# Altium schematic sheet Sheet2.SchDoc
size A4
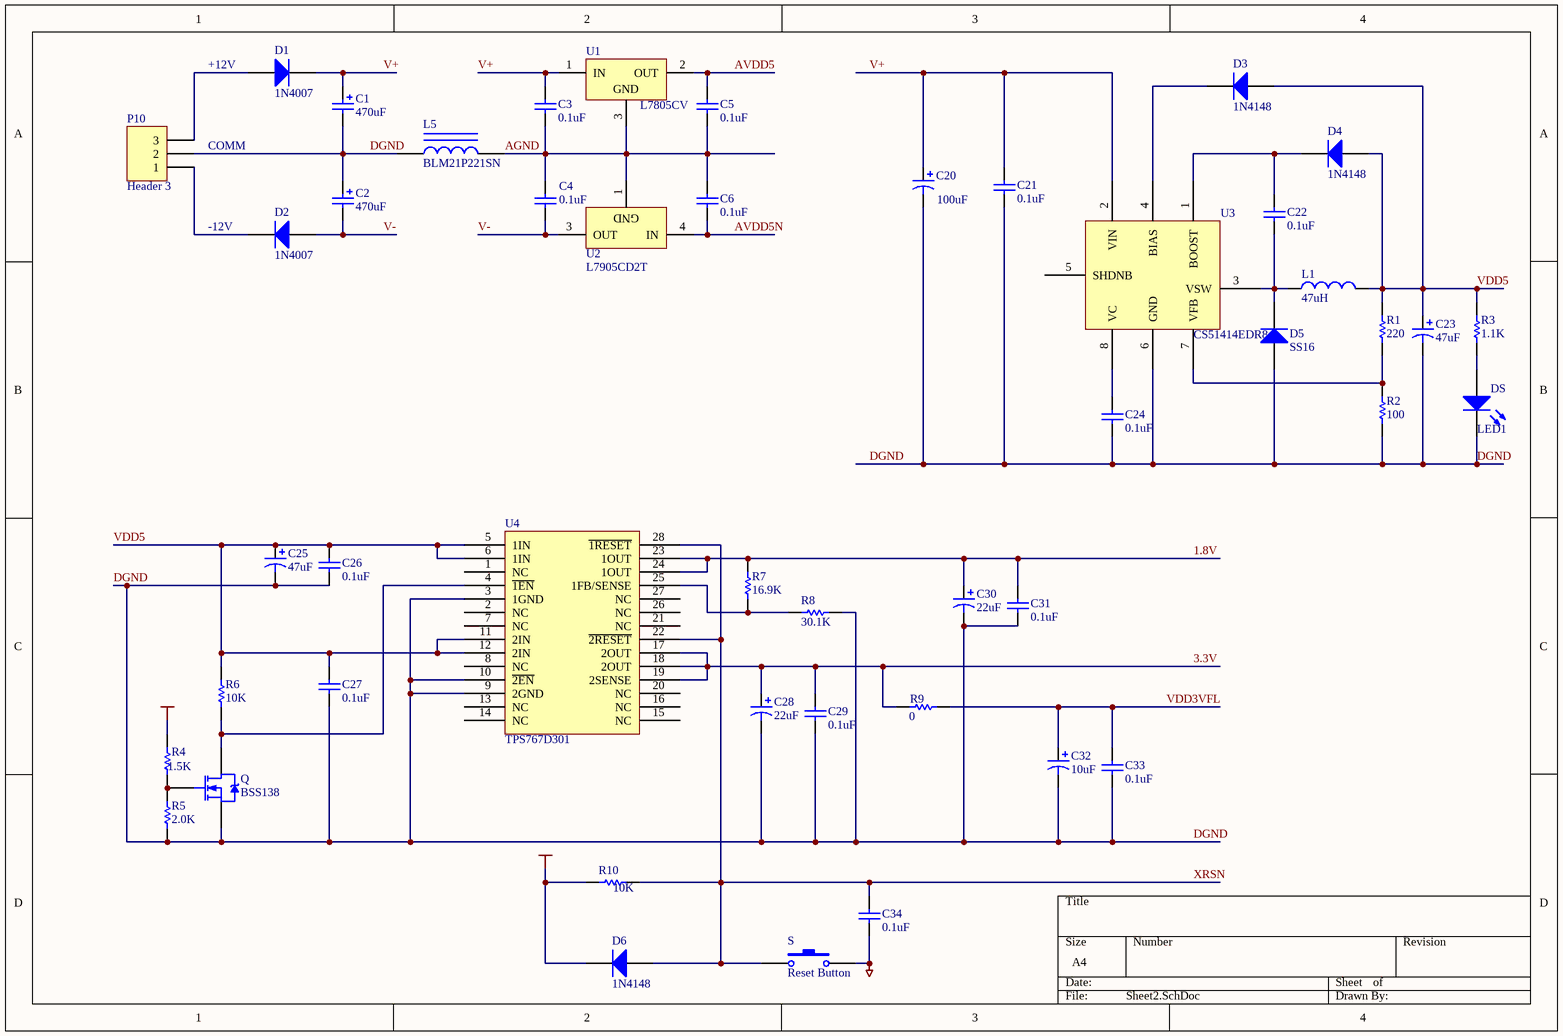
[diagram p0: Sheet2.SchDoc]

## Parts
C1  470uF  [C0915-0508]
C2  470uF  [C0915-0508]
C3  0.1uF  [CC2012-0805]
C4  0.1uF  [CC2012-0805]
C5  0.1uF  [CC2012-0805]
C6  0.1uF  [CC2012-0805]
C20  100uF  [C0915-0350]
C21  0.1uF  [CC2012-0805]
C22  0.1uF  [CC2012-0805]
C23  47uF  [CA2522-0612]
C24  0.1uF  [CC2012-0805]
C25  47uF  [CA2522-0612]
C26  0.1uF  [CC2012-0805]
C27  0.1uF  [CC2012-0805]
C28  22uF  [CA2222-0350]
C29  0.1uF  [CC2012-0805]
C30  22uF  [CA2222-0350]
C31  0.1uF  [CC2012-0805]
C32  10uF  [CA2222-0370]
C33  0.1uF  [CC2012-0805]
C34  0.1uF  [CC2012-0805]
D1  1N4007  [DO-41]
D2  1N4007  [DO-41]
D3  1N4148  [D2012-0350]
D4  1N4148  [D2012-0350]
D5  SS16  [D2220-0500]
D6  1N4148  [D2012-0350]
DS  LED1  [LED-1]
L1  47uH  [L2025-0712]
L5  BLM21P221SN  [CR2012-0805]
P10  Header 3  [HEADER3]
Q  BSS138  [SO-G3/Z3.3]
R1  220  [CR2012-0805]
R2  100  [CR2012-0805]
R3  1.1K  [CR2012-0805]
R4  1.5K  [CR2012-0805]
R5  2.0K  [CR2012-0805]
R6  10K  [CR2012-0805]
R7  16.9K  [CR2012-0805]
R8  30.1K  [CR2012-0805]
R9  0  [CR2012-0805]
R10  10K  [CR2012-0805]
S  Reset Button  [SW0915-4666]
U1  L7805CV  [TO220ABN]
U2  L7905CD2T  [TO-263]
U3  CS51414EDR8  [AD8021ARZ-1]
U4  TPS767D301  [TPS767D301]

## Nets
3.3V: C28.1 C29.2 D6.2(K) R4.2 R9.1 R10.1 U4.17(2OUT) U4.18(2OUT) U4.19(2SENSE)
DGND: C1.2 C2.1 C20.2 C21.1 C23.2 C24.1 C25.2 C26.1 C27.1 C28.2 C29.1 C30.2 C31.2 C32.2 C33.1 C34.1 D5.1(A) DS.2(K) L5.1 P10.2 Q.2(S) R2.1 R5.1 R8.2 S.2 U3.6(GND) U4.3(1GND) U4.9(2GND) U4.10(~{2EN})
1.8V: C30.1 C31.1 R7.2 U4.23(1OUT) U4.24(1OUT)
AGND: C3.1 C4.2 C5.1 C6.1 L5.2 U1.3(GND) U2.1(GND)
AVDD5: C5.2 U1.2(OUT)
AVDD5N: C6.2 U2.4(IN)
V+: C1.1 C3.2 C20.1 C21.2 D1.2(K) U1.1(IN) U3.2(VIN)
V-: C2.2 C4.1 D2.1(A) U2.3(OUT)
VDD3VFL: C32.1 C33.2 R9.2
VDD5: C23.1 C25.1 C26.2 C27.2 D3.1(A) D4.1(A) L1.2 R1.2 R3.2 R6.2 U4.5(1IN) U4.6(1IN) U4.11(2IN) U4.12(2IN)
XRSN: C34.2 D6.1(A) R10.2 S.1 U4.22(~{2RESET}) U4.28(~{1RESET})
NetC22_1: C22.1 D5.2(K) L1.1 U3.3(VSW)
NetC22_2: C22.2 D4.2(K) U3.1(BOOST)
NetC24_2: C24.2 U3.8(VC)
NetD1_1: D1.1(A) P10.3
NetD2_2: D2.2(K) P10.1
NetD3_2: D3.2(K) U3.4(BIAS)
NetDS_1: DS.1(A) R3.1
NetQ_1: Q.1(G) R4.1 R5.2
NetQ_3: Q.3(D) R6.1 U4.4(~{1EN})
NetR1_1: R1.1 R2.2 U3.7(VFB)
NetR7_1: R7.1 R8.1 U4.25(1FB/SENSE)

Not connected (* = marked no-connect by the designer): U3 5(SHDNB); U4 1(NC) 2(NC) 7(NC) 8(NC) 13(NC) 14(NC) 15(NC) 16(NC) 20(NC) 21(NC) 26(NC) 27(NC)

## Notes on the sheet
- (near D1) +12V
- (near P10) COMM
- -12V

## Library data of the parts
C1 C2 = Cap Pol2: Polarized Capacitor (Axial); Published: 8-Jun-2000; LatestRevisionDate: 17-Jul-2002; LatestRevisionNote: Re-released for DXP Platform.; Publisher: Altium Limited
C3-C6 = Cap Semi: Capacitor (Semiconductor SIM Model); Published: 8-Jun-2000; LatestRevisionDate: 17-Jul-2002; LatestRevisionNote: Re-released for DXP Platform.; PackageReference: C1206; Publisher: Altium Limited
C20 C23 C25 C28 C30 = Cap Pol1: Polarized Capacitor (Radial); Published: 8-Jun-2000; LatestRevisionDate: 17-Jul-2002; LatestRevisionNote: Re-released for DXP Platform.; Publisher: Altium Limited
C21 C22 C24 C26 C27 C29 C31 C33 C34 = Cap: Capacitor; Published: 8-Jun-2000; LatestRevisionDate: 17-Jul-2002; LatestRevisionNote: Re-released for DXP Platform.; Publisher: Altium Limited
C32 = Cap Pol3: Polarized Capacitor (Surface Mount); Published: 8-Jun-2000; LatestRevisionDate: 17-Jul-2002; LatestRevisionNote: Re-released for DXP Platform.; PackageReference: C0805; Publisher: Altium Limited
D1 D2 = 1N4007: 1.0 Ampere General Purpose Rectifier; Published: 8-Jun-2000; LatestRevisionDate: 17-Jul-2002; LatestRevisionNote: Re-released for DXP Platform.; DatasheetDocument: 1998; PackageDocument: Aug-1999; PackageReference: DO-41; Publisher: Altium Limited; ComponentLink1Description: Manufacturer Link; ComponentLink1URL: http://www.fairchildsemi.com/; Code_JEDEC: DO-204-AL
D3 D4 D6 = Diode 1N4148: High Conductance Fast Diode; Published: 8-Jun-2000; LatestRevisionDate: 17-Jul-2002; LatestRevisionNote: Re-released for DXP Platform.; DatasheetDocument: 1997; PackageReference: DO-35; Publisher: Altium Limited; ComponentLink1Description: Manufacturer Link; ComponentLink1URL: http://www.fairchildsemi.com/; Code_JEDEC: DO-204-AH
D5 = Diode: Default Diode; Published: 8-Jun-2000; LatestRevisionDate: 17-Jul-2002; LatestRevisionNote: Re-released for DXP Platform.; PackageDocument: Sep-1996; PackageReference: SMC; Publisher: Altium Limited; Code_JEDEC: DO-214-AB
DS = LED1: Typical RED GaAs LED; Published: 8-Jun-2000; LatestRevisionDate: 17-Jul-2002; LatestRevisionNote: Re-released for DXP Platform.; Publisher: Altium Limited
L1 = Inductor: Code_IEC: 1005; Published: 8-Jun-2000; LatestRevisionDate: 17-Jul-2002; LatestRevisionNote: Re-released for DXP Platform.; PackageReference: 0402-A; Publisher: Altium Limited; Code_JEITA: 0402
L5 = Inductor Iron: Magnetic-Core Inductor; Published: 24-Mar-1999; LatestRevisionDate: 17-Jul-2002; LatestRevisionNote: Re-released for DXP Platform.; Publisher: Altium Limited
P10 = Header 3: Header, 3-Pin; LatestRevisionDate: 17-Jul-2002; LatestRevisionNote: Re-released for DXP Platform.; Publisher: Altium Limited
R1-R10 = Res1: Resistor; Published: 8-Jun-2000; LatestRevisionDate: 17-Jul-2002; LatestRevisionNote: Re-released for DXP Platform.; Publisher: Altium Limited
S = SW-PB: Switch; Published: 24-Mar-1999; LatestRevisionDate: 17-Jul-2002; LatestRevisionNote: Re-released for DXP Platform.; Publisher: Altium Limited
U1 = L7805CV: Positive Voltage Regulator; Note: Tab is connected to pin 3 (GND).; Published: 24-Aug-2001; LatestRevisionDate: 17-Jul-2002; LatestRevisionNote: Re-released for DXP Platform.; DatasheetDocument: Dec-1998; PackageDocument: Jun-1998; PackageReference: TO220ABN; Publisher: Altium Limited; ComponentLink1Description: Manufacturer Link; ComponentLink1URL: http://eu.st.com/
U2 = L7905CD2T: Negative Voltage Regulator; Published: 24-Aug-2001; LatestRevisionDate: 17-Jul-2002; LatestRevisionNote: Re-released for DXP Platform.; DatasheetDocument: Apr-1997; PackageReference: TO-263; Publisher: Altium Limited; ComponentLink1Description: Manufacturer Link; ComponentLink1URL: http://eu.st.com/
U3 = CS51414